# EAGLE design tortoise_controller (EAGLE 5.11)
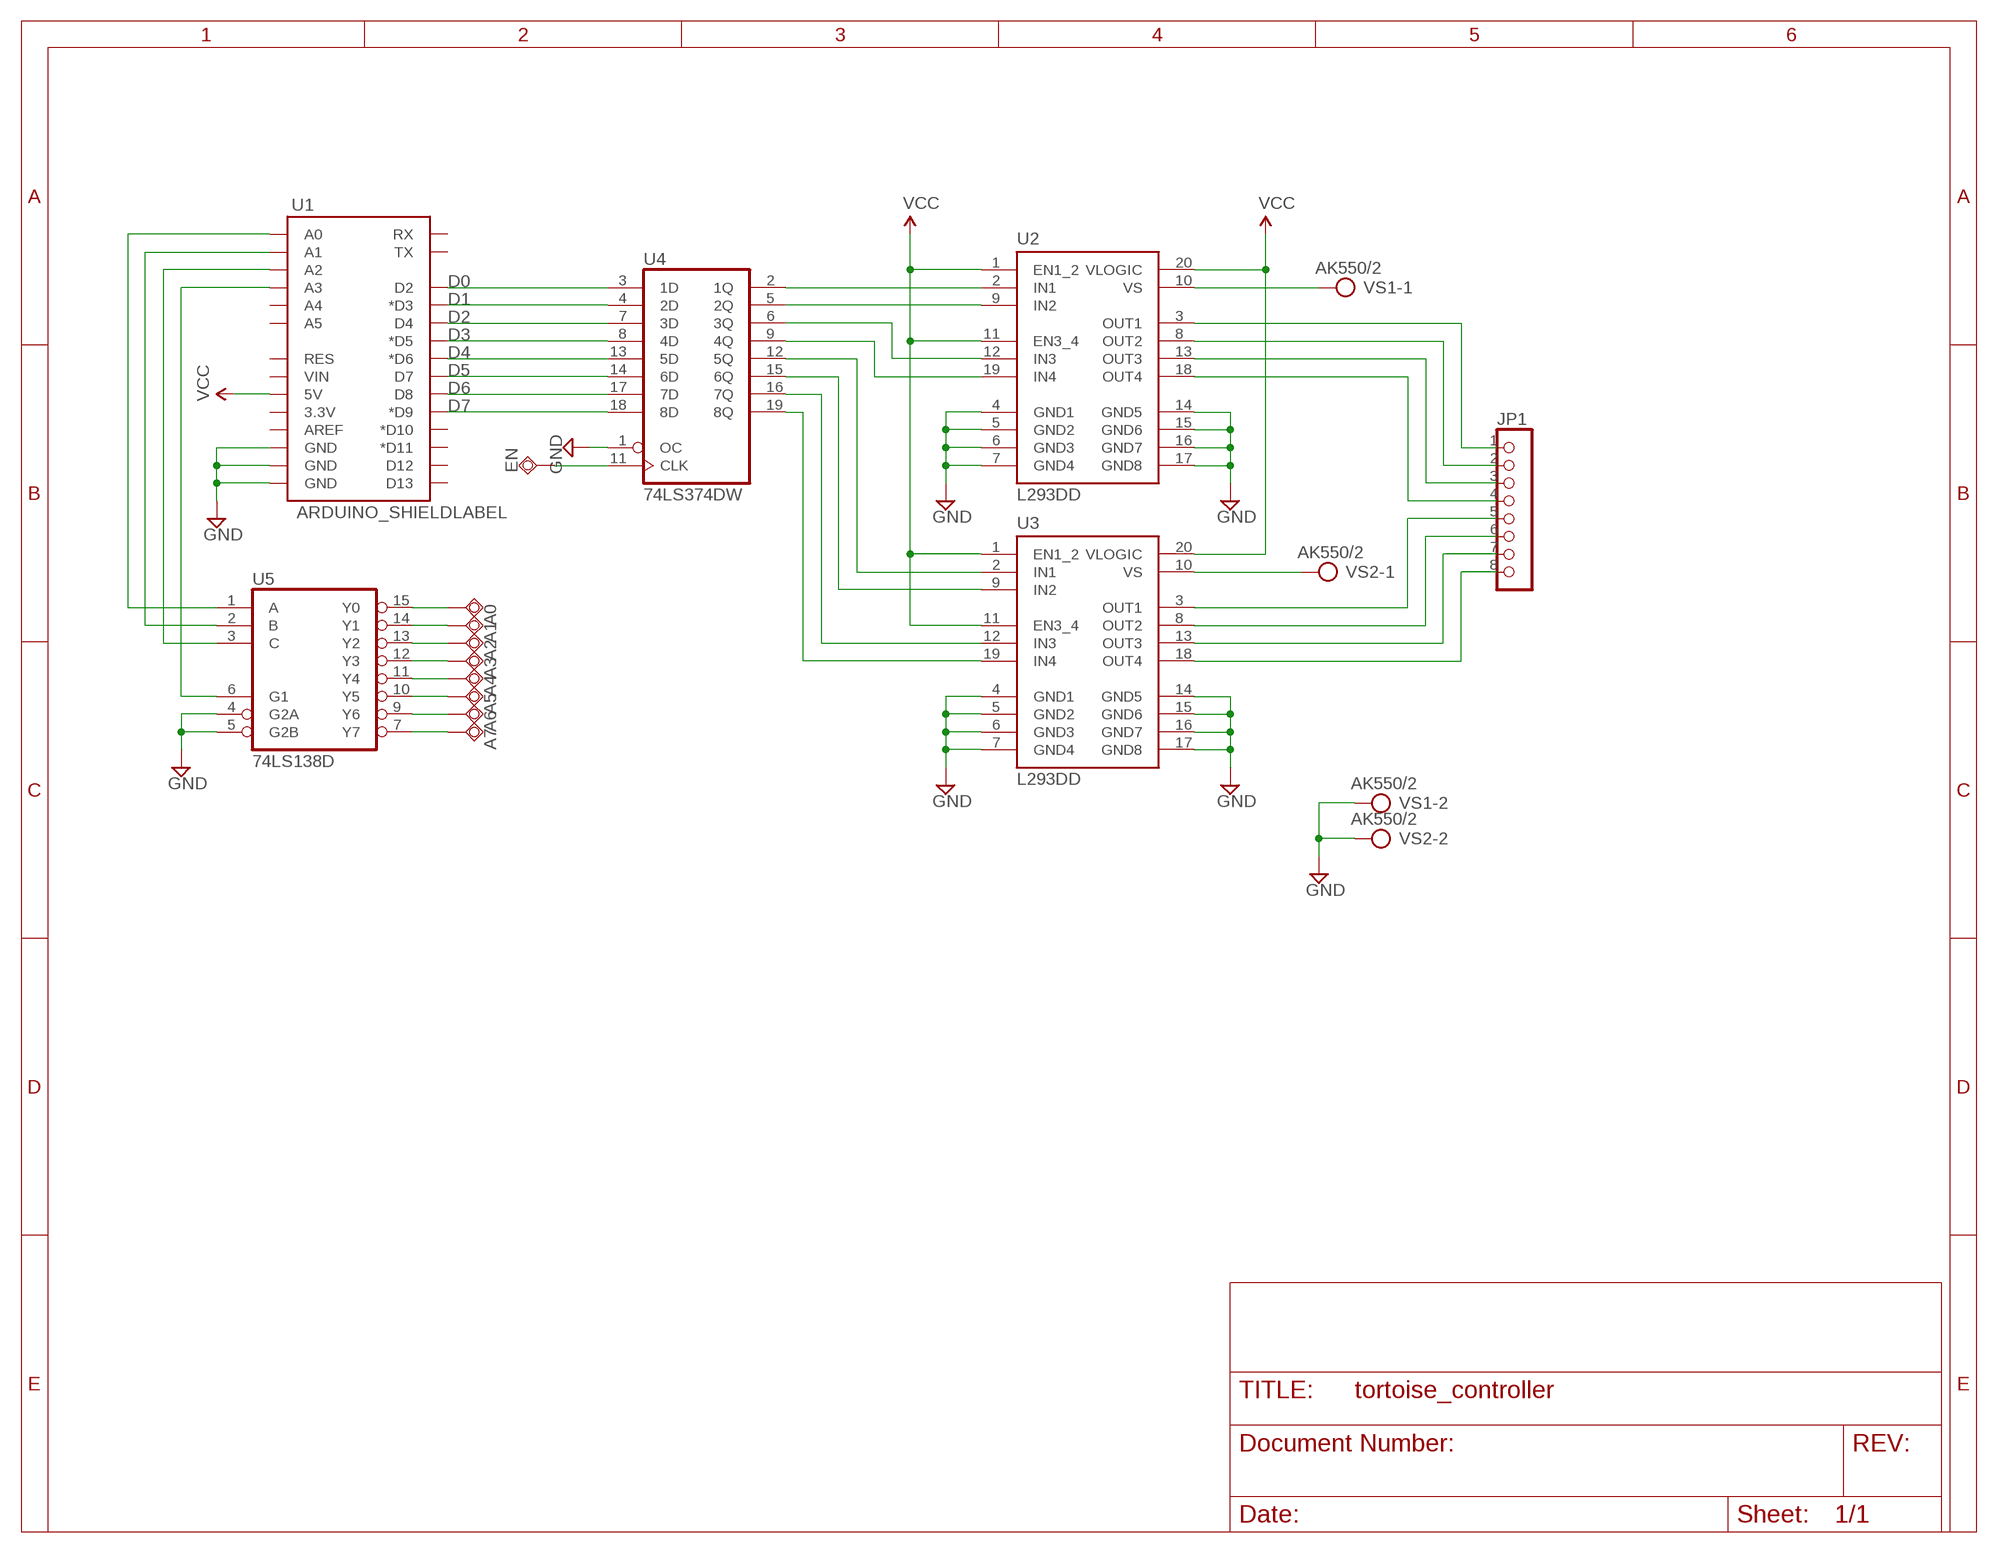
[diagram p0: schematic, sheet 1]

## Parts
A0  TPSQTP15SQ  [TP15SQ]
A1  TPSQTP15SQ  [TP15SQ]
A2  TPSQTP15SQ  [TP15SQ]
A3  TPSQTP15SQ  [TP15SQ]
A4  TPSQTP15SQ  [TP15SQ]
A5  TPSQTP15SQ  [TP15SQ]
A6  TPSQTP15SQ  [TP15SQ]
A7  TPSQTP15SQ  [TP15SQ]
EN  TPSQTP15SQ  [TP15SQ]
JP1  PINHD-1X8/90  [1X08/90]
U1  ARDUINO_SHIELDLABEL  [DUEMILANOVE_SHIELD]
U2  L293DD  [SO20]
U3  L293DD  [SO20]
U4  74LS374DW  [SO20W]
U5  74LS138D  [SO16]
VS1  AK550/2  [AK550/2]
VS2  AK550/2  [AK550/2]

## Nets
A0: U1.A0 U5.1(A)
A1: U1.A1 U5.2(B)
A2: U1.A2 U5.3(C)
A_EN: U1.A3 U5.6(G1)
ADDR0: A0.TP U5.15(Y0)
ADDR1: A1.TP U5.14(Y1)
ADDR2: A2.TP U5.13(Y2)
ADDR3: A3.TP U5.12(Y3)
ADDR4: A4.TP U5.11(Y4)
ADDR5: A5.TP U5.10(Y5)
ADDR6: A6.TP U5.9(Y6)
ADDR7: A7.TP U5.7(Y7)
D0: U1.D2 U4.3(1D)
D1: U1.D3(*D3) U4.4(2D)
D2: U1.D4 U4.7(3D)
D3: U1.D5(*D5) U4.8(4D)
D4: U1.D6(*D6) U4.13(5D)
D5: U1.D7 U4.14(6D)
D6: U1.D8 U4.17(7D)
D7: U1.D9(*D9) U4.18(8D)
GND: U1.GND@0(GND) U1.GND@1(GND) U1.GND@2(GND) U2.4(GND1) U2.5(GND2) U2.6(GND3) U2.7(GND4) U2.14(GND5) U2.15(GND6) U2.16(GND7) U2.17(GND8) U3.4(GND1) U3.5(GND2) U3.6(GND3) U3.7(GND4) U3.14(GND5) U3.15(GND6) U3.16(GND7) U3.17(GND8) U4.1(OC) U5.4(G2A) U5.5(G2B) VS1.2 VS2.2
N$1: U2.2(IN1) U4.2(1Q)
N$2: U2.9(IN2) U4.5(2Q)
N$3: U2.12(IN3) U4.6(3Q)
N$4: U2.19(IN4) U4.9(4Q)
N$5: U3.2(IN1) U4.12(5Q)
N$6: U3.9(IN2) U4.15(6Q)
N$7: U3.12(IN3) U4.16(7Q)
N$8: U3.19(IN4) U4.19(8Q)
N$9: JP1.1 U2.3(OUT1)
N$10: JP1.2 U2.8(OUT2)
N$11: JP1.3 U2.13(OUT3)
N$12: JP1.4 U2.18(OUT4)
N$13: JP1.5 U3.3(OUT1)
N$14: JP1.6 U3.8(OUT2)
N$15: JP1.7 U3.13(OUT3)
N$16: JP1.8 U3.18(OUT4)
N$17: U2.10(VS) VS1.1
N$18: U3.10(VS) VS2.1
OUT_EN: EN.TP U4.11(CLK)
VCC: U1.5V U2.1(EN1_2) U2.11(EN3_4) U2.20(VLOGIC) U3.1(EN1_2) U3.11(EN3_4) U3.20(VLOGIC)
Unconnected: U1.3.3V U1.A4 U1.A5 U1.AREF U1.D10(*D10) U1.D11(*D11) U1.D12 U1.D13 U1.RES U1.RX U1.TX U1.VIN

## Power pins joined to a net without a drawn wire
GND: U4.10(GND) U5.8(GND)
VCC: U4.20(VCC) U5.16(VCC)

## Library data of the parts
A0 A1-A7 EN = testpad:TPSQ: Test pad
JP1 = CyberRailGuru:PINHD-1X8: PIN HEADER
U1 = SparkFun:ARDUINO_SHIELD
U2 U3 = CyberRailGuru:L293DD: PUSH-PULL 4 CHANNEL DRIVER
U4 = 74xx-us:74*374: Octal D type transparent LATCH, edge triggered
U5 = 74xx-us:74*138: 3-line to 8-line DECODER/DEMULTIPLEXER
VS1 VS2 = con-ptr500:AK550/2: CONNECTOR; OC_FARNELL: unknown; OC_NEWARK: unknown

## Board
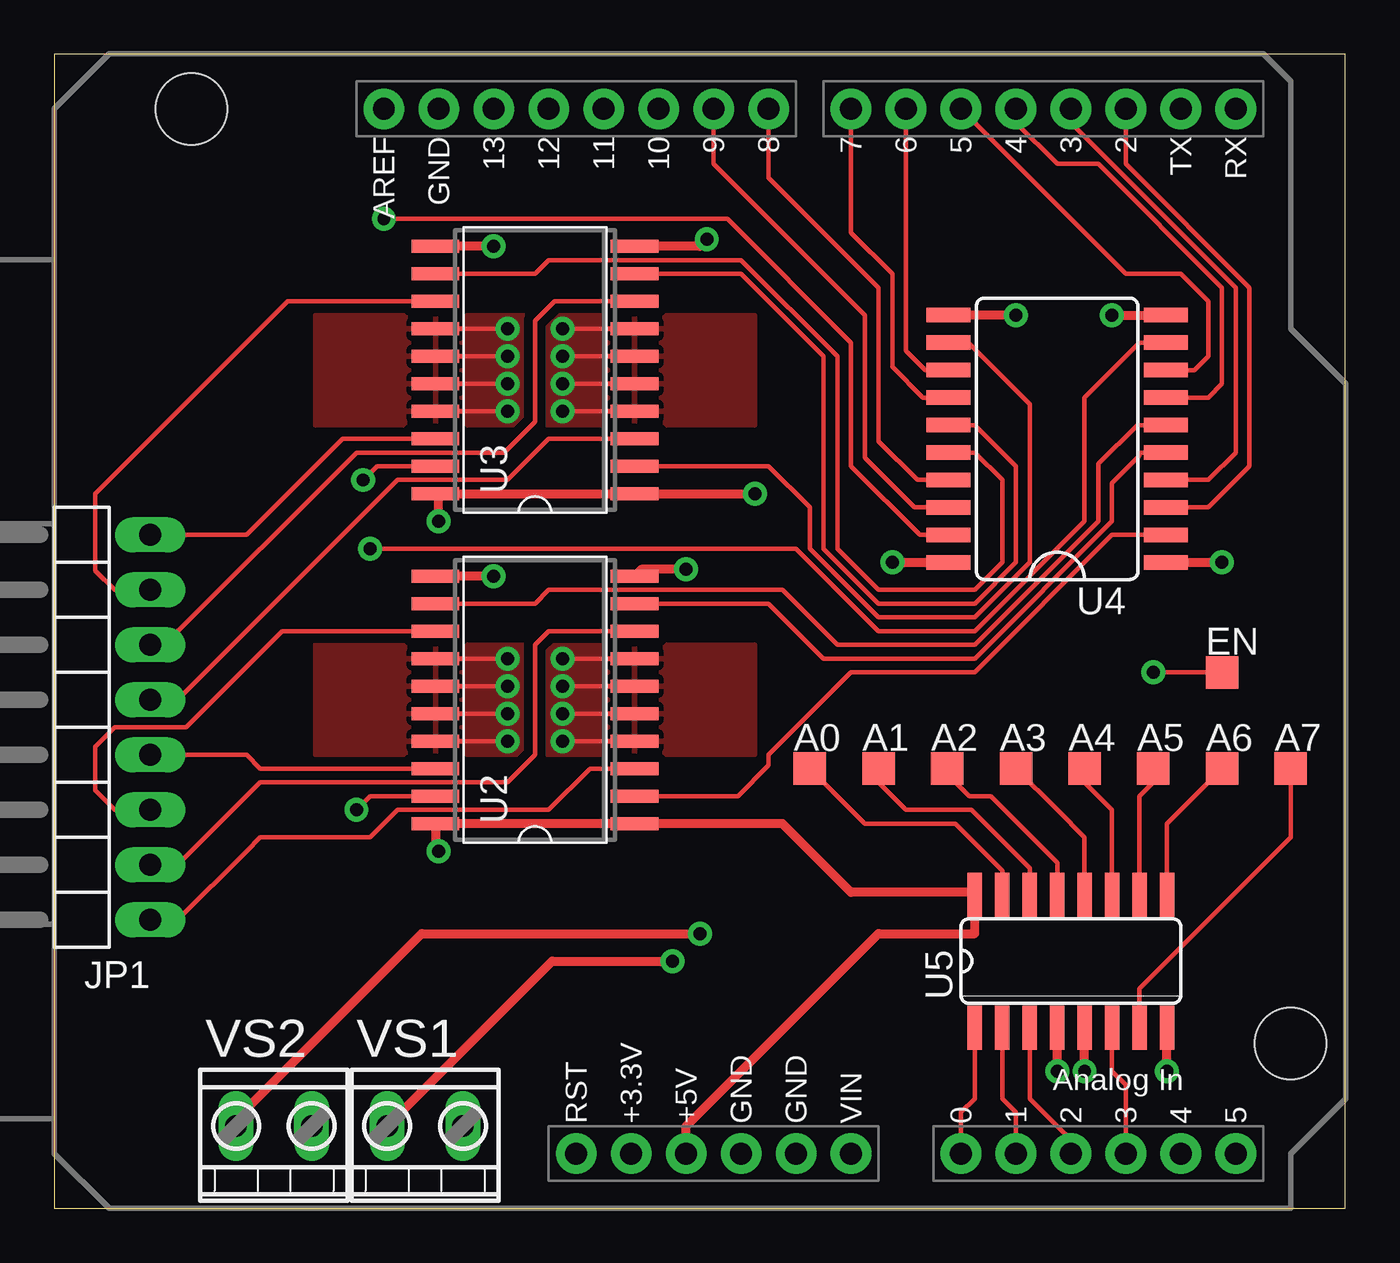
[diagram p1: board, top side]
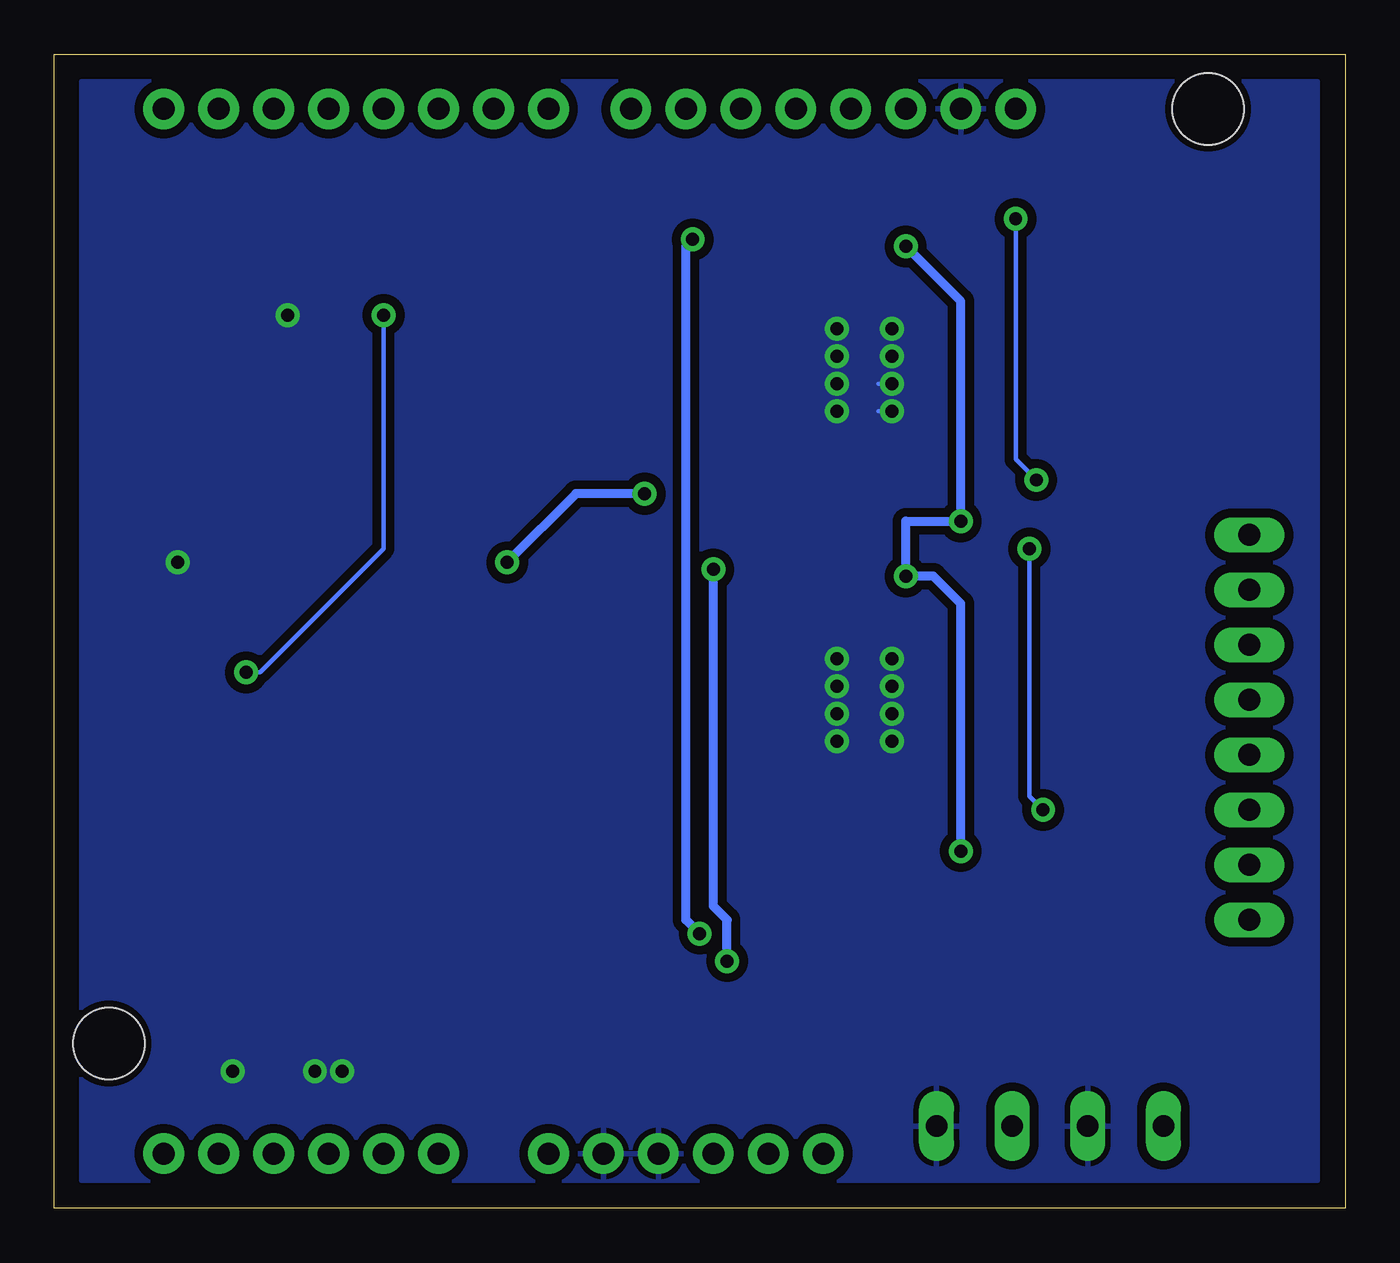
[diagram p2: board, bottom side, seen from below]

Size 59.68 x 53.33 mm. Coordinates in mm from the lower left corner, seen from the top.
Outline: 0,0 59.68,0 59.68,53.33 0,53.33 0,0
Copper layers (1*16): Top 0.035mm / dielectric 1.5mm / Bottom 0.035mm
Design rules "SparkFun *": minimum track width 8mil, minimum drill 20mil, track to track 16mil, track to pad 16mil, pad to pad 16mil, via to via 16mil, smd to smd 8mil, copper to edge 10mil, drill to drill 8mil, minimum pad ring 12mil, minimum via ring 10mil, stop-mask expansion 4mil, vias tented up to drill 25mil, thermal gap 10mil

### Footprints (pad centres in the part's own frame; a part is rotated, then mirrored left to right if it is on the bottom)
TP15SQ = smd 1.5 x 1.5: TP 0,0
1X08/90 = drill 1.016 long: 1 -8.89,-3.81; 2 -6.35,-3.81; 3 -3.81,-3.81; 4 -1.27,-3.81; 5 1.27,-3.81; 6 3.81,-3.81; 7 6.35,-3.81; 8 8.89,-3.81
DUEMILANOVE_SHIELD = drill 1.016 pad 1.88 round: 3.3V 50.8,26.67; 5V 50.8,29.21; A0 50.8,41.91; A1 50.8,44.45; A2 50.8,46.99; A3 50.8,49.53; A4 50.8,52.07; A5 50.8,54.61; AREF 2.54,15.24; D2 2.54,49.53; D3 2.54,46.99; D4 2.54,44.45; D5 2.54,41.91; D6 2.54,39.37; D7 2.54,36.83; D8 2.54,33.02; D9 2.54,30.48; D10 2.54,27.94; D11 2.54,25.4; D12 2.54,22.86; D13 2.54,20.32; GND@0 50.8,31.75; GND@1 50.8,34.29; GND@2 2.54,17.78; RES 50.8,24.13; RX 2.54,54.61; TX 2.54,52.07; VIN 50.8,36.83 | hole 3.302: 45.72,57.15; 2.54,6.35
SO20 = smd 0.6 x 2.2: 1 -5.715,-4.6; 2 -4.445,-4.6; 3 -3.175,-4.6; 4 -1.905,-4.6; 5 -0.635,-4.6; 6 0.635,-4.6; 7 1.905,-4.6; 8 3.175,-4.6; 9 4.445,-4.6; 10 5.715,-4.6; 11 5.715,4.6; 12 4.445,4.6; 13 3.175,4.6; 14 1.905,4.6; 15 0.635,4.6; 16 -0.635,4.6; 17 -1.905,4.6; 18 -3.175,4.6; 19 -4.445,4.6; 20 -5.715,4.6
SO20W = smd 0.66 x 2.032: 1 -5.715,-5.029; 2 -4.445,-5.029; 3 -3.175,-5.029; 4 -1.905,-5.029; 5 -0.635,-5.029; 6 0.635,-5.029; 7 1.905,-5.029; 8 3.175,-5.029; 9 4.445,-5.029; 10 5.715,-5.029; 11 5.715,5.029; 12 4.445,5.029; 13 3.175,5.029; 14 1.905,5.029; 15 0.635,5.029; 16 -0.635,5.029; 17 -1.905,5.029; 18 -3.175,5.029; 19 -4.445,5.029; 20 -5.715,5.029
SO16 = smd 0.66 x 2.032: 1 -4.445,-3.073; 2 -3.175,-3.073; 3 -1.905,-3.073; 4 -0.635,-3.073; 5 0.635,-3.073; 6 1.905,-3.073; 7 3.175,-3.073; 8 4.445,-3.073; 9 4.445,3.073; 10 3.175,3.073; 11 1.905,3.073; 12 0.635,3.073; 13 -0.635,3.073; 14 -1.905,3.073; 15 -3.175,3.073; 16 -4.445,3.073
AK550/2 = drill 1 pad 1.5 long: 1 -1.75,0; 2 1.75,0

### Placement (x,y rotation side)
A0  34.92,20.32 0 top
A1  38.1,20.32 0 top
A2  41.27,20.32 0 top
A3  44.45,20.32 0 top
A4  47.62,20.32 0 top
A5  50.8,20.32 0 top
A6  53.98,20.32 0 top
A7  57.15,20.32 0 top
EN  53.98,24.77 0 top
JP1  0.64,22.23 90 top
U1  0,53.34 270 top
U2  22.23,23.5 90 top
U3  22.23,38.73 90 top
U4  46.35,35.56 90 top
U5  46.99,11.43 0 top
VS1  17.14,3.81 0 top
VS2  10.16,3.81 0 top

### Tracks (layer width: path | path; a pad name or v marks a point on that pad's centre or on a via)
A0
  Top 0.203: U1.A0 41.91,4.45 42.55,5.08 U5.1
A1
  Top 0.203: U5.2 43.81,5.08 44.45,4.45 U1.A1
A2
  Top 0.203: U5.3 45.09,5.08 46.99,3.17 U1.A2
A_EN
  Top 0.203: U5.6 48.9,6.35 49.53,5.71 U1.A3
ADDR0
  Top 0.203: U5.15 43.81,15.61 41.65,17.78 37.47,17.78 A0.TP
ADDR1
  Top 0.203: U5.14 45.09,15.72 42.4,18.41 39.37,18.41 38.1,19.68 A1.TP
ADDR2
  Top 0.203: U5.13 46.35,15.98 43.29,19.05 42.29,19.05 41.27,20.07 A2.TP
ADDR3
  Top 0.203: U5.12 47.62,17.14 46.35,18.41 A3.TP
ADDR4
  Top 0.203: A4.TP 47.62,19.68 48.9,18.41 U5.11
ADDR5
  Top 0.203: A5.TP 50.8,19.68 50.16,19.05 U5.10
ADDR6
  Top 0.203: U5.9 51.44,17.78 A6.TP
ADDR7
  Top 0.203: U5.7 50.16,10.16 57.15,17.14 A7.TP
D0
  Top 0.203: U1.D2 49.53,48.26 55.24,42.55 55.24,34.29 53.34,32.38 U4.3
D1
  Top 0.203: U1.D3 46.99,50.16 54.61,42.55 54.61,34.92 53.34,33.66 U4.4
D2
  Top 0.203: 44.45,50.35 U1.D4 44.45,50.16 46.35,48.26 48.26,48.26 53.98,42.55 53.98,38.1 53.34,37.47 U4.7
D3
  Top 0.203: U1.D5 49.53,43.18 52.07,43.18 53.34,41.91 53.34,39.37 52.7,38.73 U4.8
D4
  Top 0.203: U1.D6 39.37,39.63 40.27,38.73 U4.13
D5
  Top 0.203: U1.D7 36.83,45.09 38.73,43.18 38.73,38.88 40.16,37.47 U4.14
D6
  Top 0.203: U4.17 39.9,33.66 38.1,35.45 38.1,42.55 33.02,47.62 U1.D8
D7
  Top 0.203: U4.18 39.76,32.38 37.47,34.67 37.47,41.27 30.48,48.26 U1.D9
GND  (via drill 0.6)
  Top 0.203: U3.14 v20.95,40.64 | U3.15 v20.95,39.37 | U3.16 v20.95,38.1 | v23.5,40.64 U3.7 | v23.5,21.59 U2.4 | v23.5,22.86 U2.5 | v23.5,24.13 U2.6 | v23.5,25.4 U2.7 | U2.14 v20.95,25.4 | U2.15 v20.95,24.13 | U2.16 v20.95,22.86 | U2.17 v20.95,21.59 | U3.17 v20.95,36.83 | v23.5,39.37 U3.6 | v23.5,38.1 U3.5 | v23.5,36.83 U3.4 | 51.44,41.27 U4.10
  Top 0.406: v46.35,6.35 U5.4 | v47.62,6.35 U5.5 | v51.44,6.35 U5.8 | v48.9,41.27 51.44,41.27 | U4.1 v53.98,29.84
  Bottom 0.203: v20.95,36.83 21.59,36.83 | v20.95,38.1 21.59,38.1
  pour Bottom: 1.27,1.27 1.27,52.07 58.42,52.07 58.42,1.27
  pour Top: 12.06,26.04 32.38,26.04 32.38,20.95 12.7,20.95 12.06,20.95
  pour Top: 12.06,41.27 32.38,41.27 32.38,36.2 12.06,36.2
N$1
  Top 0.203: U2.2 31.6,19.05 33.02,20.47 33.02,20.95 36.83,24.77 42.55,24.77 48.9,31.11 U4.2
N$2
  Top 0.203: U2.9 33.02,27.94 35.56,25.4 42.55,25.4 48.9,31.75 48.9,33.51 50.16,34.77 50.16,34.92 U4.5
N$3
  Top 0.203: U2.12 22.23,27.94 22.86,28.57 33.66,28.57 36.2,26.04 42.55,26.04 48.26,31.75 48.26,34.4 50.06,36.2 U4.6
N$4  (via drill 0.6)
  Top 0.203: U2.19 14.61,19.05 v13.97,18.41 | U4.9 50.16,40.01 47.62,37.47 47.62,31.75 42.55,26.67 38.1,26.67 34.29,30.48 v14.61,30.48
  Bottom 0.203: v13.97,18.41 14.61,19.05 v14.61,30.48
N$5
  Top 0.203: U4.12 42.24,40.01 45.09,37.16 45.09,29.84 42.55,27.3 38.1,27.3 34.92,30.48 34.92,32.38 33.02,34.29 U3.2
N$6
  Top 0.203: U4.15 42.55,36.2 44.45,34.29 44.45,29.84 42.55,27.94 38.1,27.94 35.56,30.48 35.56,39.37 31.75,43.18 U3.9
N$7
  Top 0.203: U3.12 22.23,43.18 22.86,43.81 31.75,43.81 36.2,39.37 36.2,30.48 38.1,28.57 42.55,28.57 43.81,29.84 43.81,33.66 42.55,34.92 U4.16
N$8  (via drill 0.6)
  Top 0.203: U3.19 14.92,34.29 v14.29,33.66 | U4.19 40.01,31.11 36.83,34.29 36.83,40.01 31.11,45.72 v15.24,45.72
  Bottom 0.203: v14.29,33.66 15.24,34.61 v15.24,45.72
N$9
  Top 0.203: U2.3 24.77,20.32 22.86,18.41 15.88,18.41 14.61,17.14 9.53,17.14 8.89,16.51 5.71,13.34 JP1.1
N$10
  Top 0.203: U2.8 22.86,26.67 22.23,26.04 22.23,20.95 20.95,19.68 9.53,19.68 5.71,15.88 JP1.2
N$11
  Top 0.203: U2.13 10.54,26.67 10.16,26.29 6.09,22.23 2.8,22.23 1.91,21.33 1.91,19.31 2.8,18.41 JP1.3
N$12
  Top 0.203: U2.18 9.53,20.32 8.89,20.95 JP1.4
N$13
  Top 0.203: U3.3 22.86,35.56 20.95,33.66 15.88,33.66 5.71,23.5 5.71,23.56 5.65,23.5 JP1.5
N$14
  Top 0.203: U3.8 23.12,41.91 22.23,41.01 22.23,36.34 20.8,34.92 13.97,34.92 5.08,26.04 JP1.6
N$15
  Top 0.203: JP1.7 2.8,28.57 1.91,29.47 1.91,33.02 10.79,41.91 U3.13
N$16
  Top 0.203: JP1.8 8.89,31.11 13.34,35.56 U3.18
N$17  (via drill 0.6)
  Top 0.406: v28.57,11.43 23.02,11.43 15.88,4.29 VS1.1 | v29.21,29.53 27.14,29.53 U2.10
  Bottom 0.406: v29.21,29.53 29.21,13.97 28.57,13.34 v28.57,11.43
N$18  (via drill 0.6)
  Top 0.406: U3.10 29.84,44.45 v30.16,44.77 | v29.84,12.7 16.99,12.7 8.26,3.96 VS2.1
  Bottom 0.406: v30.16,44.77 30.48,44.45 30.48,13.34 v29.84,12.7
OUT_EN  (via drill 0.6)
  Top 0.203: v50.8,24.77 EN.TP
  Top 0.406: v44.45,41.27 U4.11
  Bottom 0.203: v44.45,41.27 44.45,30.48 50.16,24.77 v50.8,24.77
VCC  (via drill 0.6)
  Top 0.203: U5.16 42.55,14.61
  Top 0.406: v20.32,29.21 U2.11 | v32.38,33.02 U3.1 U3.20 17.78,32.87 v17.78,31.75 | v38.73,29.84 U4.20 | U1.5V 29.21,3.81 38.1,12.7 42.55,12.7 U5.16 42.44,14.61 36.83,14.61 33.66,17.78 U2.1 U2.20 17.62,16.66 v17.78,16.51 | v20.32,44.45 U3.11
  Bottom 0.406: v17.78,16.51 17.78,27.94 19.05,29.21 v20.32,29.21 20.32,31.75 v17.78,31.75 17.78,41.91 v20.32,44.45 | v32.38,33.02 35.56,33.02 v38.73,29.84